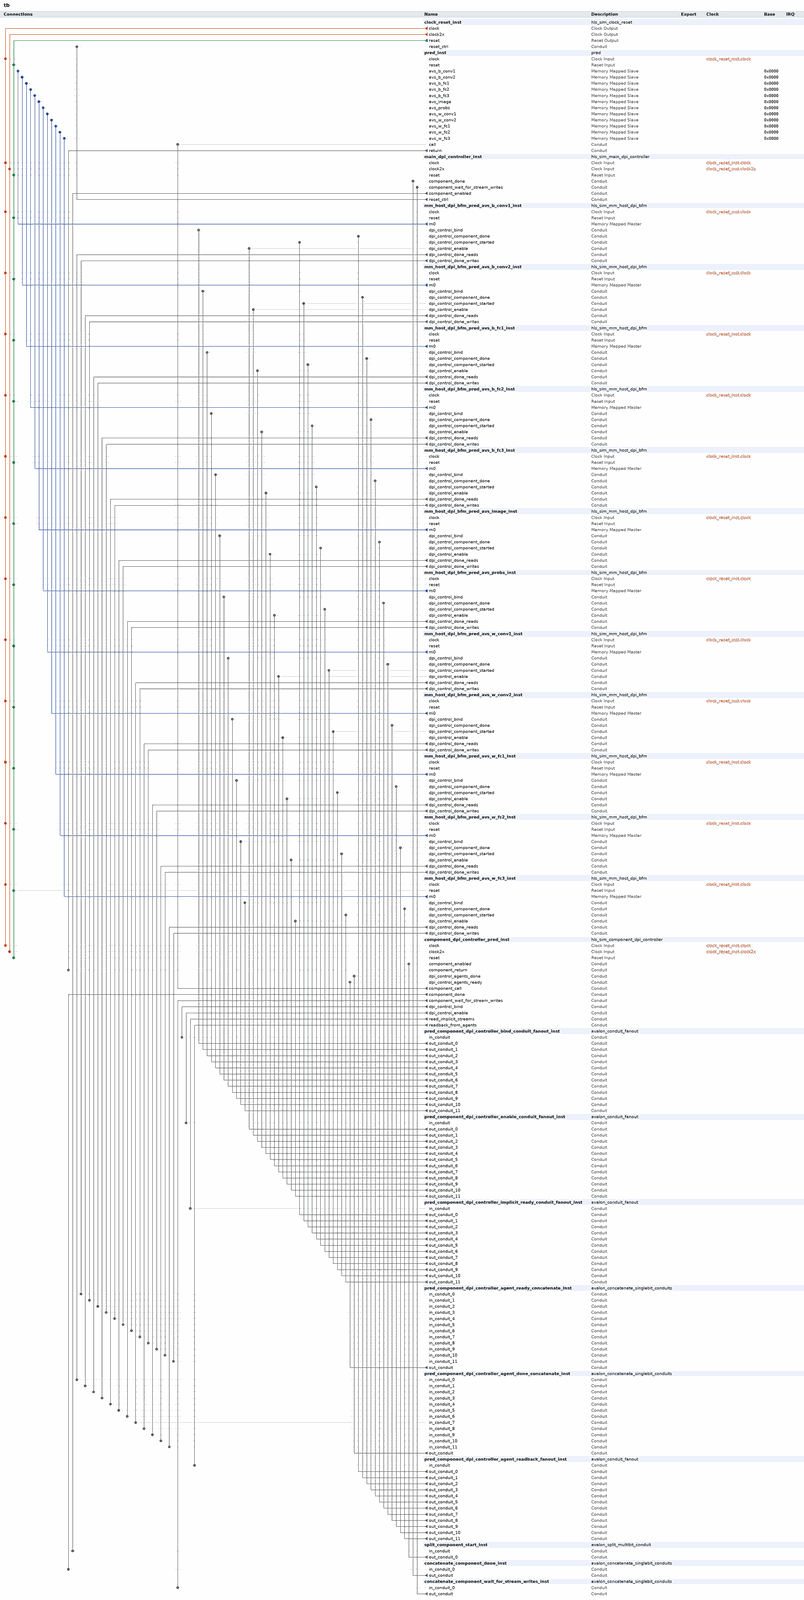
[diagram p0: system contents, whole]
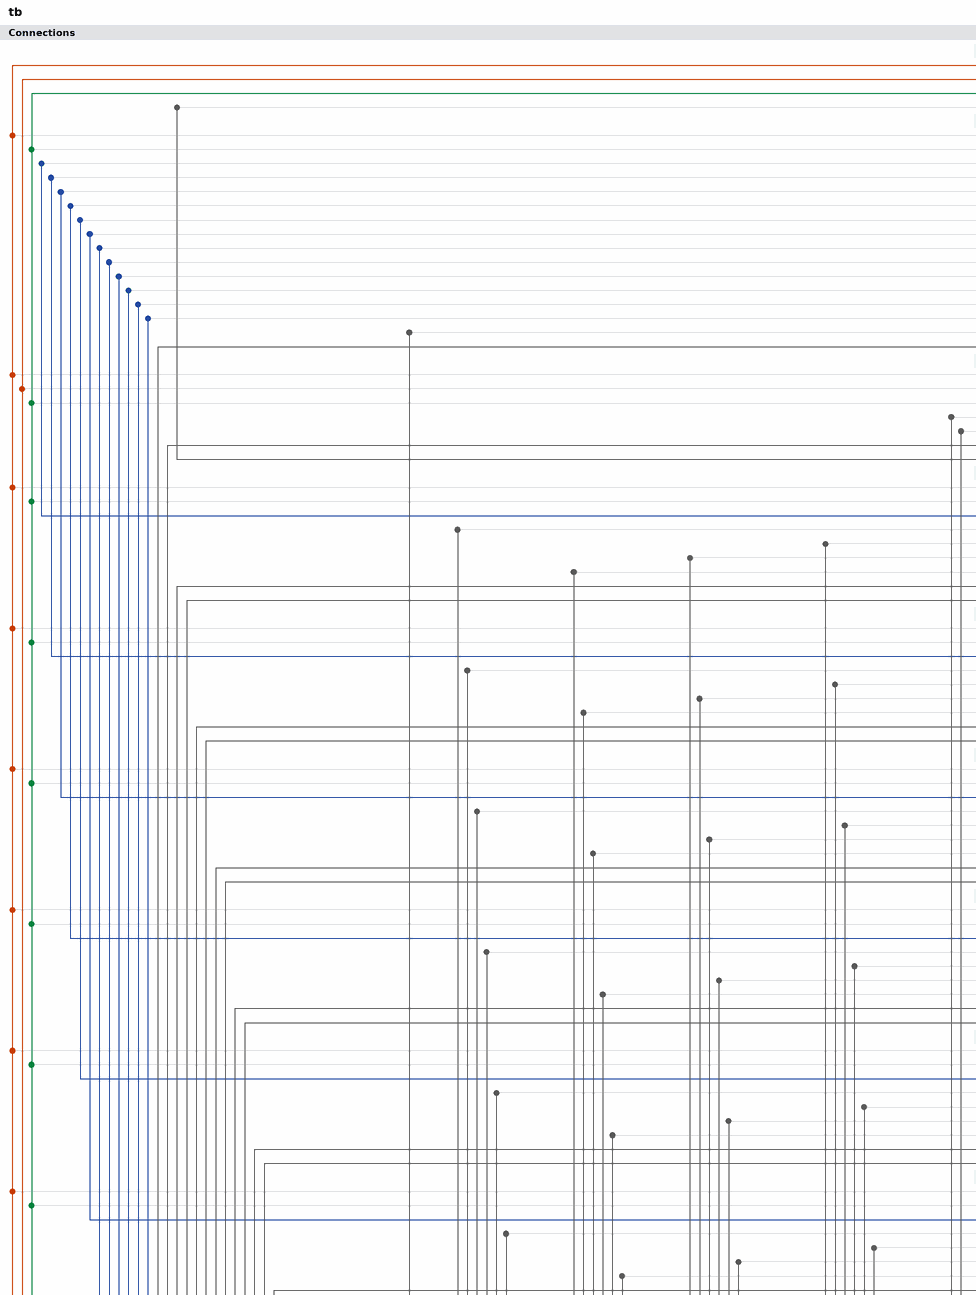
[diagram p1: system contents, upper left part]
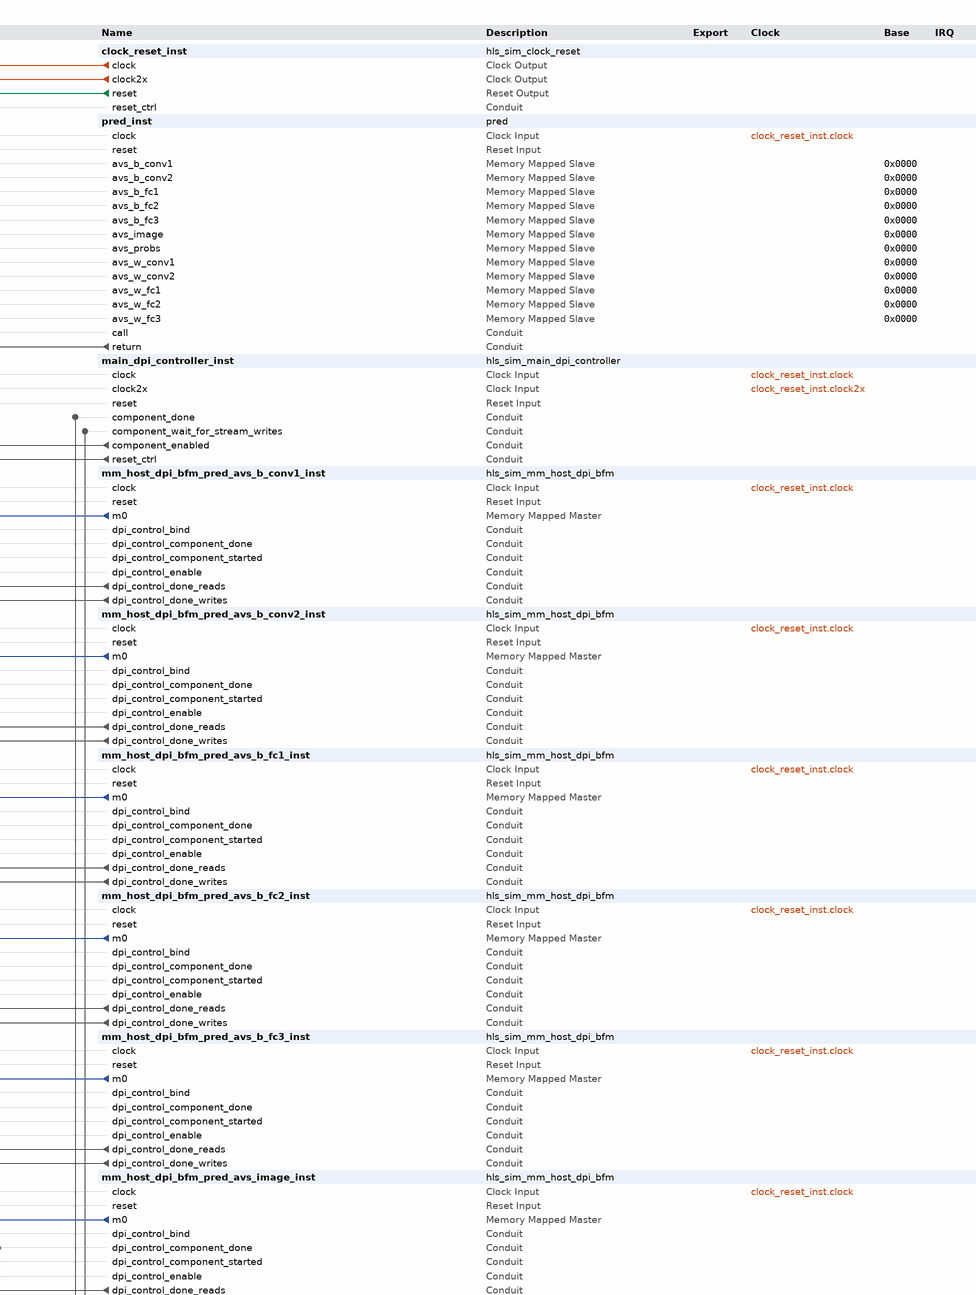
[diagram p2: system contents, upper right part]
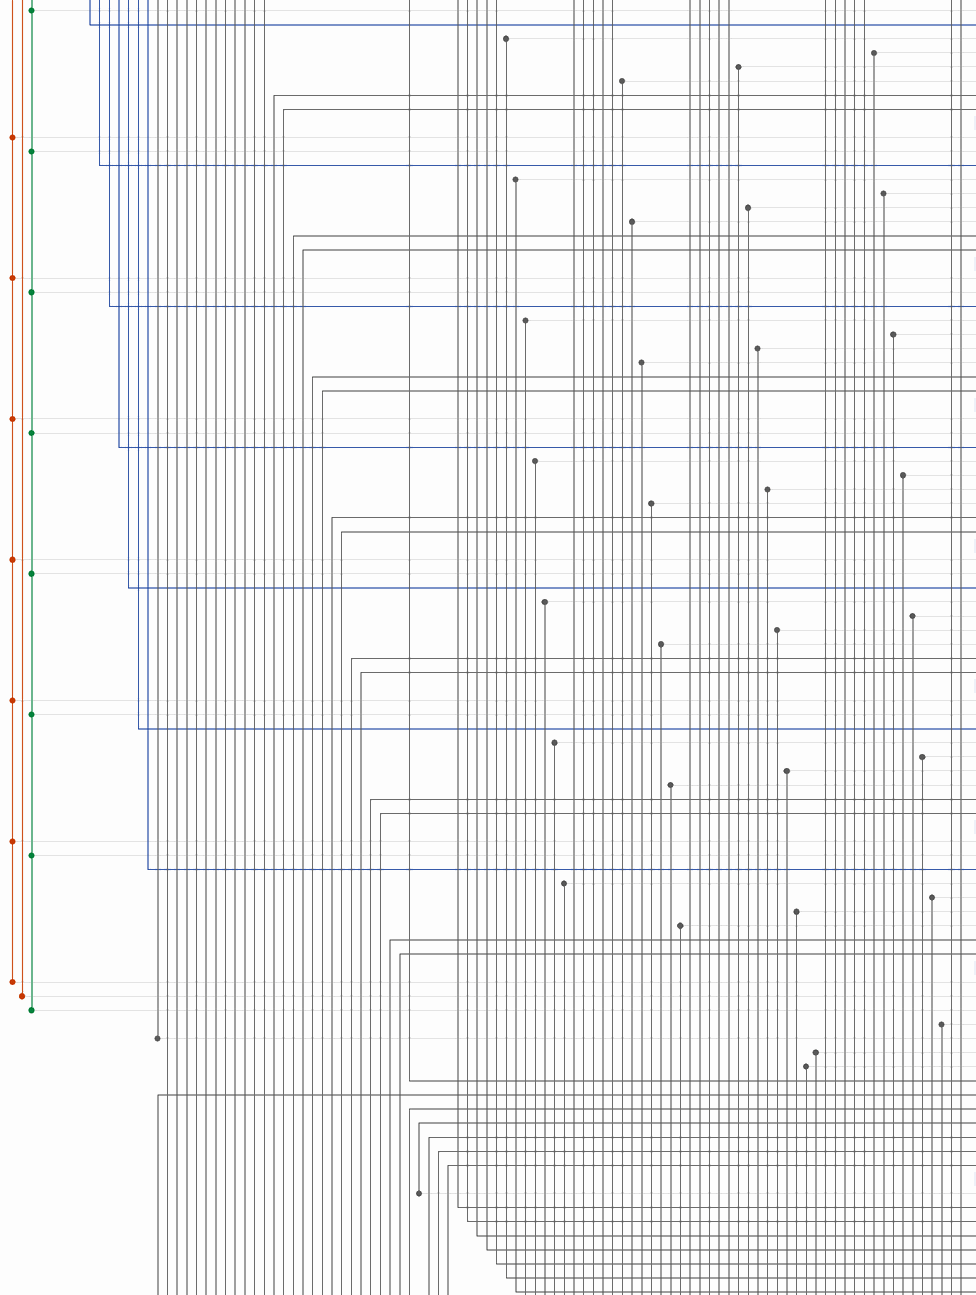
[diagram p3: system contents, middle left part]
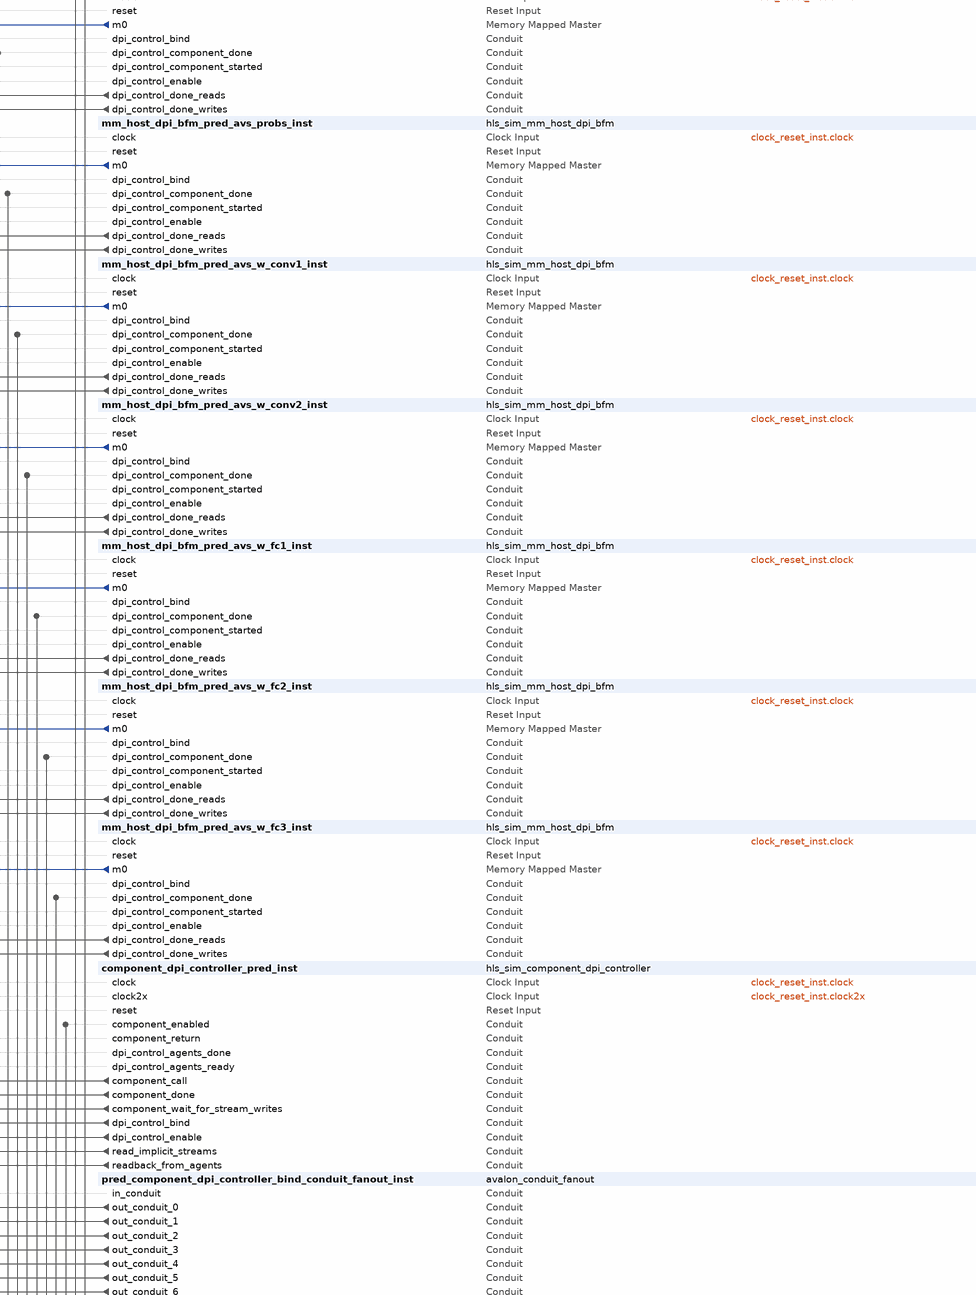
[diagram p4: system contents, middle right part]
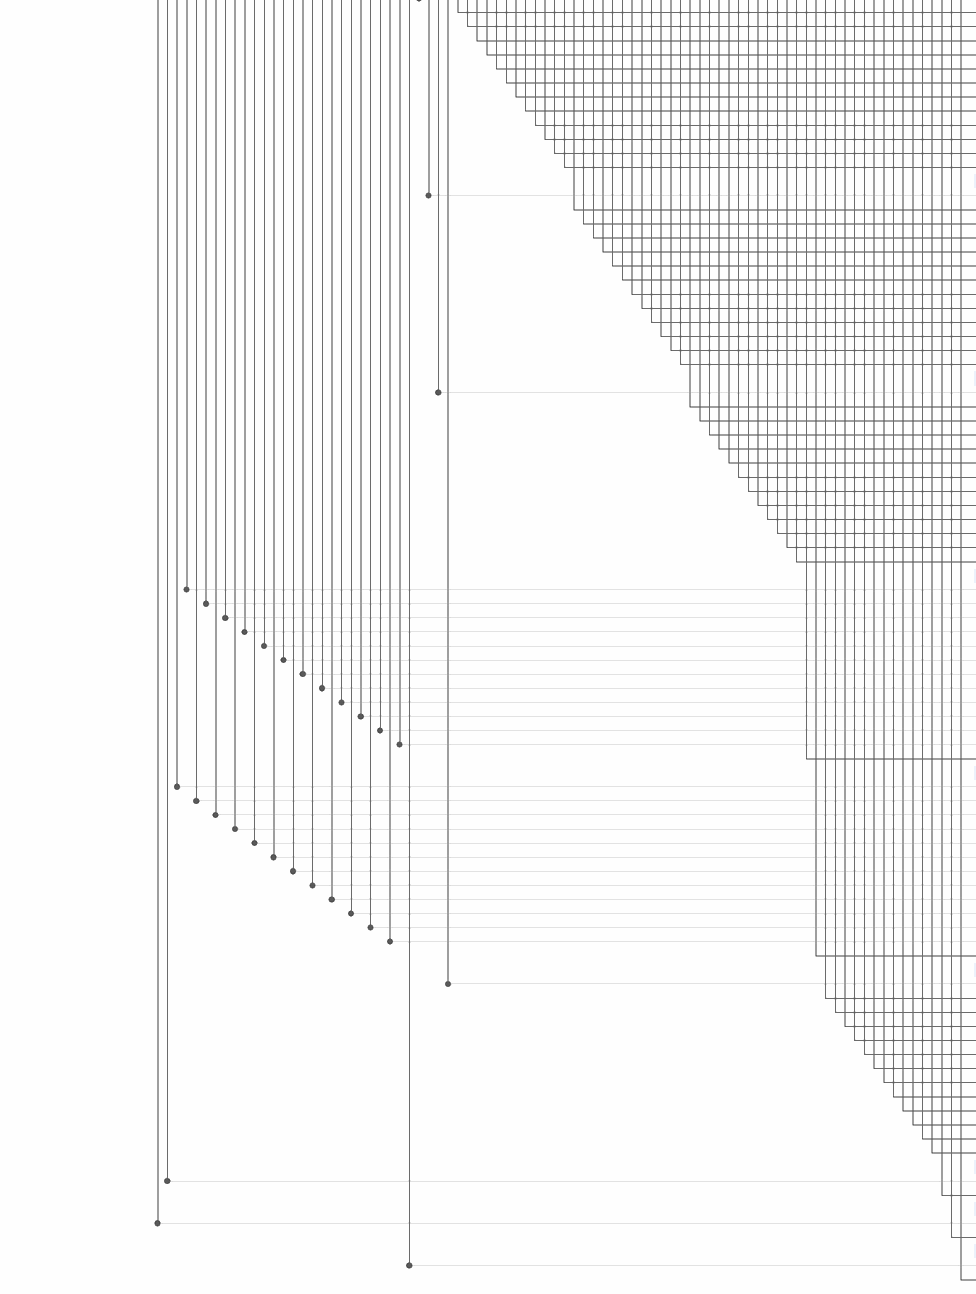
[diagram p5: system contents, lower left part]
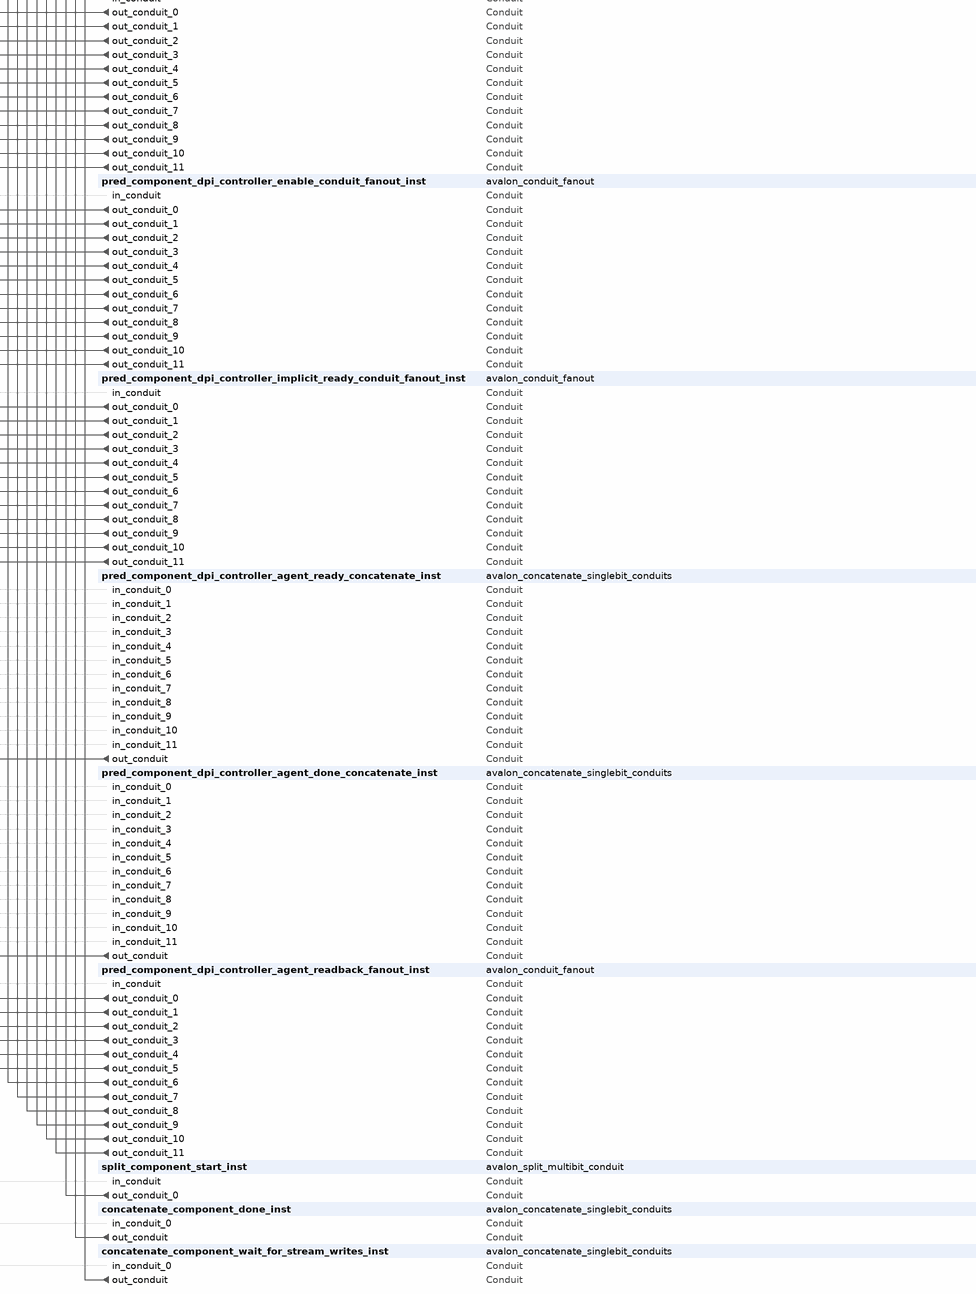
[diagram p6: system contents, lower right part]
# Platform Designer (Qsys) system tb, Cyclone V 5CGXFC3B6F23C6
# Parameters at their usual value, and those the tool derives, are not listed.
package require qsys
create_system tb
set_project_property DEVICE_FAMILY {Cyclone V}
set_project_property DEVICE 5CGXFC3B6F23C6

add_instance clock_reset_inst hls_sim_clock_reset 1.0
set_instance_parameter_value clock_reset_inst RESET_CYCLE_HOLD 4

add_instance pred_inst pred 1.0

add_instance main_dpi_controller_inst hls_sim_main_dpi_controller 1.0
set_instance_parameter_value main_dpi_controller_inst COMPONENT_NAMES_STR pred
set_instance_parameter_value main_dpi_controller_inst NUM_COMPONENTS 1

add_instance mm_host_dpi_bfm_pred_avs_b_conv1_inst hls_sim_mm_host_dpi_bfm 1.0
set_instance_parameter_value mm_host_dpi_bfm_pred_avs_b_conv1_inst ADDRESS_UNITS SYMBOLS
set_instance_parameter_value mm_host_dpi_bfm_pred_avs_b_conv1_inst AV_ADDRESS_W 5
set_instance_parameter_value mm_host_dpi_bfm_pred_avs_b_conv1_inst AV_BURSTCOUNT_W 1
set_instance_parameter_value mm_host_dpi_bfm_pred_avs_b_conv1_inst AV_BURST_BNDR_ONLY 1
set_instance_parameter_value mm_host_dpi_bfm_pred_avs_b_conv1_inst AV_BURST_LINEWRAP 1
set_instance_parameter_value mm_host_dpi_bfm_pred_avs_b_conv1_inst AV_FIX_READ_LATENCY 3
set_instance_parameter_value mm_host_dpi_bfm_pred_avs_b_conv1_inst AV_NUMSYMBOLS 1
set_instance_parameter_value mm_host_dpi_bfm_pred_avs_b_conv1_inst AV_READ_WAIT_TIME 0
set_instance_parameter_value mm_host_dpi_bfm_pred_avs_b_conv1_inst AV_REGISTERINCOMINGSIGNALS 0
set_instance_parameter_value mm_host_dpi_bfm_pred_avs_b_conv1_inst AV_SYMBOL_W 8
set_instance_parameter_value mm_host_dpi_bfm_pred_avs_b_conv1_inst AV_WRITE_WAIT_TIME 0
set_instance_parameter_value mm_host_dpi_bfm_pred_avs_b_conv1_inst COMPONENT_AGENT_READ_INTERFACE_NAME b_conv1_avs_readback
set_instance_parameter_value mm_host_dpi_bfm_pred_avs_b_conv1_inst COMPONENT_AGENT_WRITE_INTERFACE_NAME b_conv1
set_instance_parameter_value mm_host_dpi_bfm_pred_avs_b_conv1_inst COMPONENT_CRA_AGENT 0
set_instance_parameter_value mm_host_dpi_bfm_pred_avs_b_conv1_inst COMPONENT_HAS_AGENT_RETURN 0
set_instance_parameter_value mm_host_dpi_bfm_pred_avs_b_conv1_inst COMPONENT_NAME pred
set_instance_parameter_value mm_host_dpi_bfm_pred_avs_b_conv1_inst NUM_AGENT_MEMORIES 0
set_instance_parameter_value mm_host_dpi_bfm_pred_avs_b_conv1_inst REGISTER_WAITREQUEST 0
set_instance_parameter_value mm_host_dpi_bfm_pred_avs_b_conv1_inst USE_ADDRESS 1
set_instance_parameter_value mm_host_dpi_bfm_pred_avs_b_conv1_inst USE_BEGIN_BURST_TRANSFER 0
set_instance_parameter_value mm_host_dpi_bfm_pred_avs_b_conv1_inst USE_BEGIN_TRANSFER 0
set_instance_parameter_value mm_host_dpi_bfm_pred_avs_b_conv1_inst USE_BURSTCOUNT 0
set_instance_parameter_value mm_host_dpi_bfm_pred_avs_b_conv1_inst USE_BYTE_ENABLE 1
set_instance_parameter_value mm_host_dpi_bfm_pred_avs_b_conv1_inst USE_READ 1
set_instance_parameter_value mm_host_dpi_bfm_pred_avs_b_conv1_inst USE_READ_DATA 1
set_instance_parameter_value mm_host_dpi_bfm_pred_avs_b_conv1_inst USE_READ_DATA_VALID 1
set_instance_parameter_value mm_host_dpi_bfm_pred_avs_b_conv1_inst USE_WAIT_REQUEST 1
set_instance_parameter_value mm_host_dpi_bfm_pred_avs_b_conv1_inst USE_WRITE 1
set_instance_parameter_value mm_host_dpi_bfm_pred_avs_b_conv1_inst USE_WRITE_DATA 1

add_instance mm_host_dpi_bfm_pred_avs_b_conv2_inst hls_sim_mm_host_dpi_bfm 1.0
set_instance_parameter_value mm_host_dpi_bfm_pred_avs_b_conv2_inst ADDRESS_UNITS SYMBOLS
set_instance_parameter_value mm_host_dpi_bfm_pred_avs_b_conv2_inst AV_ADDRESS_W 6
set_instance_parameter_value mm_host_dpi_bfm_pred_avs_b_conv2_inst AV_BURSTCOUNT_W 1
set_instance_parameter_value mm_host_dpi_bfm_pred_avs_b_conv2_inst AV_BURST_BNDR_ONLY 1
set_instance_parameter_value mm_host_dpi_bfm_pred_avs_b_conv2_inst AV_BURST_LINEWRAP 1
set_instance_parameter_value mm_host_dpi_bfm_pred_avs_b_conv2_inst AV_FIX_READ_LATENCY 3
set_instance_parameter_value mm_host_dpi_bfm_pred_avs_b_conv2_inst AV_NUMSYMBOLS 1
set_instance_parameter_value mm_host_dpi_bfm_pred_avs_b_conv2_inst AV_READ_WAIT_TIME 0
set_instance_parameter_value mm_host_dpi_bfm_pred_avs_b_conv2_inst AV_REGISTERINCOMINGSIGNALS 0
set_instance_parameter_value mm_host_dpi_bfm_pred_avs_b_conv2_inst AV_SYMBOL_W 8
set_instance_parameter_value mm_host_dpi_bfm_pred_avs_b_conv2_inst AV_WRITE_WAIT_TIME 0
set_instance_parameter_value mm_host_dpi_bfm_pred_avs_b_conv2_inst COMPONENT_AGENT_READ_INTERFACE_NAME b_conv2_avs_readback
set_instance_parameter_value mm_host_dpi_bfm_pred_avs_b_conv2_inst COMPONENT_AGENT_WRITE_INTERFACE_NAME b_conv2
set_instance_parameter_value mm_host_dpi_bfm_pred_avs_b_conv2_inst COMPONENT_CRA_AGENT 0
set_instance_parameter_value mm_host_dpi_bfm_pred_avs_b_conv2_inst COMPONENT_HAS_AGENT_RETURN 0
set_instance_parameter_value mm_host_dpi_bfm_pred_avs_b_conv2_inst COMPONENT_NAME pred
set_instance_parameter_value mm_host_dpi_bfm_pred_avs_b_conv2_inst NUM_AGENT_MEMORIES 0
set_instance_parameter_value mm_host_dpi_bfm_pred_avs_b_conv2_inst REGISTER_WAITREQUEST 0
set_instance_parameter_value mm_host_dpi_bfm_pred_avs_b_conv2_inst USE_ADDRESS 1
set_instance_parameter_value mm_host_dpi_bfm_pred_avs_b_conv2_inst USE_BEGIN_BURST_TRANSFER 0
set_instance_parameter_value mm_host_dpi_bfm_pred_avs_b_conv2_inst USE_BEGIN_TRANSFER 0
set_instance_parameter_value mm_host_dpi_bfm_pred_avs_b_conv2_inst USE_BURSTCOUNT 0
set_instance_parameter_value mm_host_dpi_bfm_pred_avs_b_conv2_inst USE_BYTE_ENABLE 1
set_instance_parameter_value mm_host_dpi_bfm_pred_avs_b_conv2_inst USE_READ 1
set_instance_parameter_value mm_host_dpi_bfm_pred_avs_b_conv2_inst USE_READ_DATA 1
set_instance_parameter_value mm_host_dpi_bfm_pred_avs_b_conv2_inst USE_READ_DATA_VALID 1
set_instance_parameter_value mm_host_dpi_bfm_pred_avs_b_conv2_inst USE_WAIT_REQUEST 1
set_instance_parameter_value mm_host_dpi_bfm_pred_avs_b_conv2_inst USE_WRITE 1
set_instance_parameter_value mm_host_dpi_bfm_pred_avs_b_conv2_inst USE_WRITE_DATA 1

add_instance mm_host_dpi_bfm_pred_avs_b_fc1_inst hls_sim_mm_host_dpi_bfm 1.0
set_instance_parameter_value mm_host_dpi_bfm_pred_avs_b_fc1_inst ADDRESS_UNITS SYMBOLS
set_instance_parameter_value mm_host_dpi_bfm_pred_avs_b_fc1_inst AV_ADDRESS_W 9
set_instance_parameter_value mm_host_dpi_bfm_pred_avs_b_fc1_inst AV_BURSTCOUNT_W 1
set_instance_parameter_value mm_host_dpi_bfm_pred_avs_b_fc1_inst AV_BURST_BNDR_ONLY 1
set_instance_parameter_value mm_host_dpi_bfm_pred_avs_b_fc1_inst AV_BURST_LINEWRAP 1
set_instance_parameter_value mm_host_dpi_bfm_pred_avs_b_fc1_inst AV_FIX_READ_LATENCY 3
set_instance_parameter_value mm_host_dpi_bfm_pred_avs_b_fc1_inst AV_NUMSYMBOLS 1
set_instance_parameter_value mm_host_dpi_bfm_pred_avs_b_fc1_inst AV_READ_WAIT_TIME 0
set_instance_parameter_value mm_host_dpi_bfm_pred_avs_b_fc1_inst AV_REGISTERINCOMINGSIGNALS 0
set_instance_parameter_value mm_host_dpi_bfm_pred_avs_b_fc1_inst AV_SYMBOL_W 8
set_instance_parameter_value mm_host_dpi_bfm_pred_avs_b_fc1_inst AV_WRITE_WAIT_TIME 0
set_instance_parameter_value mm_host_dpi_bfm_pred_avs_b_fc1_inst COMPONENT_AGENT_READ_INTERFACE_NAME b_fc1_avs_readback
set_instance_parameter_value mm_host_dpi_bfm_pred_avs_b_fc1_inst COMPONENT_AGENT_WRITE_INTERFACE_NAME b_fc1
set_instance_parameter_value mm_host_dpi_bfm_pred_avs_b_fc1_inst COMPONENT_CRA_AGENT 0
set_instance_parameter_value mm_host_dpi_bfm_pred_avs_b_fc1_inst COMPONENT_HAS_AGENT_RETURN 0
set_instance_parameter_value mm_host_dpi_bfm_pred_avs_b_fc1_inst COMPONENT_NAME pred
set_instance_parameter_value mm_host_dpi_bfm_pred_avs_b_fc1_inst NUM_AGENT_MEMORIES 0
set_instance_parameter_value mm_host_dpi_bfm_pred_avs_b_fc1_inst REGISTER_WAITREQUEST 0
set_instance_parameter_value mm_host_dpi_bfm_pred_avs_b_fc1_inst USE_ADDRESS 1
set_instance_parameter_value mm_host_dpi_bfm_pred_avs_b_fc1_inst USE_BEGIN_BURST_TRANSFER 0
set_instance_parameter_value mm_host_dpi_bfm_pred_avs_b_fc1_inst USE_BEGIN_TRANSFER 0
set_instance_parameter_value mm_host_dpi_bfm_pred_avs_b_fc1_inst USE_BURSTCOUNT 0
set_instance_parameter_value mm_host_dpi_bfm_pred_avs_b_fc1_inst USE_BYTE_ENABLE 1
set_instance_parameter_value mm_host_dpi_bfm_pred_avs_b_fc1_inst USE_READ 1
set_instance_parameter_value mm_host_dpi_bfm_pred_avs_b_fc1_inst USE_READ_DATA 1
set_instance_parameter_value mm_host_dpi_bfm_pred_avs_b_fc1_inst USE_READ_DATA_VALID 1
set_instance_parameter_value mm_host_dpi_bfm_pred_avs_b_fc1_inst USE_WAIT_REQUEST 1
set_instance_parameter_value mm_host_dpi_bfm_pred_avs_b_fc1_inst USE_WRITE 1
set_instance_parameter_value mm_host_dpi_bfm_pred_avs_b_fc1_inst USE_WRITE_DATA 1

add_instance mm_host_dpi_bfm_pred_avs_b_fc2_inst hls_sim_mm_host_dpi_bfm 1.0
set_instance_parameter_value mm_host_dpi_bfm_pred_avs_b_fc2_inst ADDRESS_UNITS SYMBOLS
set_instance_parameter_value mm_host_dpi_bfm_pred_avs_b_fc2_inst AV_ADDRESS_W 9
set_instance_parameter_value mm_host_dpi_bfm_pred_avs_b_fc2_inst AV_BURSTCOUNT_W 1
set_instance_parameter_value mm_host_dpi_bfm_pred_avs_b_fc2_inst AV_BURST_BNDR_ONLY 1
set_instance_parameter_value mm_host_dpi_bfm_pred_avs_b_fc2_inst AV_BURST_LINEWRAP 1
set_instance_parameter_value mm_host_dpi_bfm_pred_avs_b_fc2_inst AV_FIX_READ_LATENCY 3
set_instance_parameter_value mm_host_dpi_bfm_pred_avs_b_fc2_inst AV_NUMSYMBOLS 1
set_instance_parameter_value mm_host_dpi_bfm_pred_avs_b_fc2_inst AV_READ_WAIT_TIME 0
set_instance_parameter_value mm_host_dpi_bfm_pred_avs_b_fc2_inst AV_REGISTERINCOMINGSIGNALS 0
set_instance_parameter_value mm_host_dpi_bfm_pred_avs_b_fc2_inst AV_SYMBOL_W 8
set_instance_parameter_value mm_host_dpi_bfm_pred_avs_b_fc2_inst AV_WRITE_WAIT_TIME 0
set_instance_parameter_value mm_host_dpi_bfm_pred_avs_b_fc2_inst COMPONENT_AGENT_READ_INTERFACE_NAME b_fc2_avs_readback
set_instance_parameter_value mm_host_dpi_bfm_pred_avs_b_fc2_inst COMPONENT_AGENT_WRITE_INTERFACE_NAME b_fc2
set_instance_parameter_value mm_host_dpi_bfm_pred_avs_b_fc2_inst COMPONENT_CRA_AGENT 0
set_instance_parameter_value mm_host_dpi_bfm_pred_avs_b_fc2_inst COMPONENT_HAS_AGENT_RETURN 0
set_instance_parameter_value mm_host_dpi_bfm_pred_avs_b_fc2_inst COMPONENT_NAME pred
set_instance_parameter_value mm_host_dpi_bfm_pred_avs_b_fc2_inst NUM_AGENT_MEMORIES 0
set_instance_parameter_value mm_host_dpi_bfm_pred_avs_b_fc2_inst REGISTER_WAITREQUEST 0
set_instance_parameter_value mm_host_dpi_bfm_pred_avs_b_fc2_inst USE_ADDRESS 1
set_instance_parameter_value mm_host_dpi_bfm_pred_avs_b_fc2_inst USE_BEGIN_BURST_TRANSFER 0
set_instance_parameter_value mm_host_dpi_bfm_pred_avs_b_fc2_inst USE_BEGIN_TRANSFER 0
set_instance_parameter_value mm_host_dpi_bfm_pred_avs_b_fc2_inst USE_BURSTCOUNT 0
set_instance_parameter_value mm_host_dpi_bfm_pred_avs_b_fc2_inst USE_BYTE_ENABLE 1
set_instance_parameter_value mm_host_dpi_bfm_pred_avs_b_fc2_inst USE_READ 1
set_instance_parameter_value mm_host_dpi_bfm_pred_avs_b_fc2_inst USE_READ_DATA 1
set_instance_parameter_value mm_host_dpi_bfm_pred_avs_b_fc2_inst USE_READ_DATA_VALID 1
set_instance_parameter_value mm_host_dpi_bfm_pred_avs_b_fc2_inst USE_WAIT_REQUEST 1
set_instance_parameter_value mm_host_dpi_bfm_pred_avs_b_fc2_inst USE_WRITE 1
set_instance_parameter_value mm_host_dpi_bfm_pred_avs_b_fc2_inst USE_WRITE_DATA 1

add_instance mm_host_dpi_bfm_pred_avs_b_fc3_inst hls_sim_mm_host_dpi_bfm 1.0
set_instance_parameter_value mm_host_dpi_bfm_pred_avs_b_fc3_inst ADDRESS_UNITS SYMBOLS
set_instance_parameter_value mm_host_dpi_bfm_pred_avs_b_fc3_inst AV_ADDRESS_W 6
set_instance_parameter_value mm_host_dpi_bfm_pred_avs_b_fc3_inst AV_BURSTCOUNT_W 1
set_instance_parameter_value mm_host_dpi_bfm_pred_avs_b_fc3_inst AV_BURST_BNDR_ONLY 1
set_instance_parameter_value mm_host_dpi_bfm_pred_avs_b_fc3_inst AV_BURST_LINEWRAP 1
set_instance_parameter_value mm_host_dpi_bfm_pred_avs_b_fc3_inst AV_FIX_READ_LATENCY 3
set_instance_parameter_value mm_host_dpi_bfm_pred_avs_b_fc3_inst AV_NUMSYMBOLS 1
set_instance_parameter_value mm_host_dpi_bfm_pred_avs_b_fc3_inst AV_READ_WAIT_TIME 0
set_instance_parameter_value mm_host_dpi_bfm_pred_avs_b_fc3_inst AV_REGISTERINCOMINGSIGNALS 0
set_instance_parameter_value mm_host_dpi_bfm_pred_avs_b_fc3_inst AV_SYMBOL_W 8
set_instance_parameter_value mm_host_dpi_bfm_pred_avs_b_fc3_inst AV_WRITE_WAIT_TIME 0
set_instance_parameter_value mm_host_dpi_bfm_pred_avs_b_fc3_inst COMPONENT_AGENT_READ_INTERFACE_NAME b_fc3_avs_readback
set_instance_parameter_value mm_host_dpi_bfm_pred_avs_b_fc3_inst COMPONENT_AGENT_WRITE_INTERFACE_NAME b_fc3
set_instance_parameter_value mm_host_dpi_bfm_pred_avs_b_fc3_inst COMPONENT_CRA_AGENT 0
set_instance_parameter_value mm_host_dpi_bfm_pred_avs_b_fc3_inst COMPONENT_HAS_AGENT_RETURN 0
set_instance_parameter_value mm_host_dpi_bfm_pred_avs_b_fc3_inst COMPONENT_NAME pred
set_instance_parameter_value mm_host_dpi_bfm_pred_avs_b_fc3_inst NUM_AGENT_MEMORIES 0
set_instance_parameter_value mm_host_dpi_bfm_pred_avs_b_fc3_inst REGISTER_WAITREQUEST 0
set_instance_parameter_value mm_host_dpi_bfm_pred_avs_b_fc3_inst USE_ADDRESS 1
set_instance_parameter_value mm_host_dpi_bfm_pred_avs_b_fc3_inst USE_BEGIN_BURST_TRANSFER 0
set_instance_parameter_value mm_host_dpi_bfm_pred_avs_b_fc3_inst USE_BEGIN_TRANSFER 0
set_instance_parameter_value mm_host_dpi_bfm_pred_avs_b_fc3_inst USE_BURSTCOUNT 0
set_instance_parameter_value mm_host_dpi_bfm_pred_avs_b_fc3_inst USE_BYTE_ENABLE 1
set_instance_parameter_value mm_host_dpi_bfm_pred_avs_b_fc3_inst USE_READ 1
set_instance_parameter_value mm_host_dpi_bfm_pred_avs_b_fc3_inst USE_READ_DATA 1
set_instance_parameter_value mm_host_dpi_bfm_pred_avs_b_fc3_inst USE_READ_DATA_VALID 1
set_instance_parameter_value mm_host_dpi_bfm_pred_avs_b_fc3_inst USE_WAIT_REQUEST 1
set_instance_parameter_value mm_host_dpi_bfm_pred_avs_b_fc3_inst USE_WRITE 1
set_instance_parameter_value mm_host_dpi_bfm_pred_avs_b_fc3_inst USE_WRITE_DATA 1

add_instance mm_host_dpi_bfm_pred_avs_image_inst hls_sim_mm_host_dpi_bfm 1.0
set_instance_parameter_value mm_host_dpi_bfm_pred_avs_image_inst ADDRESS_UNITS SYMBOLS
set_instance_parameter_value mm_host_dpi_bfm_pred_avs_image_inst AV_ADDRESS_W 12
set_instance_parameter_value mm_host_dpi_bfm_pred_avs_image_inst AV_BURSTCOUNT_W 1
set_instance_parameter_value mm_host_dpi_bfm_pred_avs_image_inst AV_BURST_BNDR_ONLY 1
set_instance_parameter_value mm_host_dpi_bfm_pred_avs_image_inst AV_BURST_LINEWRAP 1
set_instance_parameter_value mm_host_dpi_bfm_pred_avs_image_inst AV_FIX_READ_LATENCY 3
set_instance_parameter_value mm_host_dpi_bfm_pred_avs_image_inst AV_NUMSYMBOLS 1
set_instance_parameter_value mm_host_dpi_bfm_pred_avs_image_inst AV_READ_WAIT_TIME 0
set_instance_parameter_value mm_host_dpi_bfm_pred_avs_image_inst AV_REGISTERINCOMINGSIGNALS 0
set_instance_parameter_value mm_host_dpi_bfm_pred_avs_image_inst AV_SYMBOL_W 8
set_instance_parameter_value mm_host_dpi_bfm_pred_avs_image_inst AV_WRITE_WAIT_TIME 0
set_instance_parameter_value mm_host_dpi_bfm_pred_avs_image_inst COMPONENT_AGENT_READ_INTERFACE_NAME image_avs_readback
set_instance_parameter_value mm_host_dpi_bfm_pred_avs_image_inst COMPONENT_AGENT_WRITE_INTERFACE_NAME image
set_instance_parameter_value mm_host_dpi_bfm_pred_avs_image_inst COMPONENT_CRA_AGENT 0
set_instance_parameter_value mm_host_dpi_bfm_pred_avs_image_inst COMPONENT_HAS_AGENT_RETURN 0
set_instance_parameter_value mm_host_dpi_bfm_pred_avs_image_inst COMPONENT_NAME pred
set_instance_parameter_value mm_host_dpi_bfm_pred_avs_image_inst NUM_AGENT_MEMORIES 0
set_instance_parameter_value mm_host_dpi_bfm_pred_avs_image_inst REGISTER_WAITREQUEST 0
set_instance_parameter_value mm_host_dpi_bfm_pred_avs_image_inst USE_ADDRESS 1
set_instance_parameter_value mm_host_dpi_bfm_pred_avs_image_inst USE_BEGIN_BURST_TRANSFER 0
set_instance_parameter_value mm_host_dpi_bfm_pred_avs_image_inst USE_BEGIN_TRANSFER 0
set_instance_parameter_value mm_host_dpi_bfm_pred_avs_image_inst USE_BURSTCOUNT 0
set_instance_parameter_value mm_host_dpi_bfm_pred_avs_image_inst USE_BYTE_ENABLE 1
set_instance_parameter_value mm_host_dpi_bfm_pred_avs_image_inst USE_READ 1
set_instance_parameter_value mm_host_dpi_bfm_pred_avs_image_inst USE_READ_DATA 1
set_instance_parameter_value mm_host_dpi_bfm_pred_avs_image_inst USE_READ_DATA_VALID 1
set_instance_parameter_value mm_host_dpi_bfm_pred_avs_image_inst USE_WAIT_REQUEST 1
set_instance_parameter_value mm_host_dpi_bfm_pred_avs_image_inst USE_WRITE 1
set_instance_parameter_value mm_host_dpi_bfm_pred_avs_image_inst USE_WRITE_DATA 1

add_instance mm_host_dpi_bfm_pred_avs_probs_inst hls_sim_mm_host_dpi_bfm 1.0
set_instance_parameter_value mm_host_dpi_bfm_pred_avs_probs_inst ADDRESS_UNITS SYMBOLS
set_instance_parameter_value mm_host_dpi_bfm_pred_avs_probs_inst AV_ADDRESS_W 6
set_instance_parameter_value mm_host_dpi_bfm_pred_avs_probs_inst AV_BURSTCOUNT_W 1
set_instance_parameter_value mm_host_dpi_bfm_pred_avs_probs_inst AV_BURST_BNDR_ONLY 1
set_instance_parameter_value mm_host_dpi_bfm_pred_avs_probs_inst AV_BURST_LINEWRAP 1
set_instance_parameter_value mm_host_dpi_bfm_pred_avs_probs_inst AV_FIX_READ_LATENCY 3
set_instance_parameter_value mm_host_dpi_bfm_pred_avs_probs_inst AV_NUMSYMBOLS 1
set_instance_parameter_value mm_host_dpi_bfm_pred_avs_probs_inst AV_READ_WAIT_TIME 0
set_instance_parameter_value mm_host_dpi_bfm_pred_avs_probs_inst AV_REGISTERINCOMINGSIGNALS 0
set_instance_parameter_value mm_host_dpi_bfm_pred_avs_probs_inst AV_SYMBOL_W 8
set_instance_parameter_value mm_host_dpi_bfm_pred_avs_probs_inst AV_WRITE_WAIT_TIME 0
set_instance_parameter_value mm_host_dpi_bfm_pred_avs_probs_inst COMPONENT_AGENT_READ_INTERFACE_NAME probs_avs_readback
set_instance_parameter_value mm_host_dpi_bfm_pred_avs_probs_inst COMPONENT_AGENT_WRITE_INTERFACE_NAME probs
set_instance_parameter_value mm_host_dpi_bfm_pred_avs_probs_inst COMPONENT_CRA_AGENT 0
set_instance_parameter_value mm_host_dpi_bfm_pred_avs_probs_inst COMPONENT_HAS_AGENT_RETURN 0
set_instance_parameter_value mm_host_dpi_bfm_pred_avs_probs_inst COMPONENT_NAME pred
set_instance_parameter_value mm_host_dpi_bfm_pred_avs_probs_inst NUM_AGENT_MEMORIES 0
set_instance_parameter_value mm_host_dpi_bfm_pred_avs_probs_inst REGISTER_WAITREQUEST 0
set_instance_parameter_value mm_host_dpi_bfm_pred_avs_probs_inst USE_ADDRESS 1
set_instance_parameter_value mm_host_dpi_bfm_pred_avs_probs_inst USE_BEGIN_BURST_TRANSFER 0
set_instance_parameter_value mm_host_dpi_bfm_pred_avs_probs_inst USE_BEGIN_TRANSFER 0
set_instance_parameter_value mm_host_dpi_bfm_pred_avs_probs_inst USE_BURSTCOUNT 0
set_instance_parameter_value mm_host_dpi_bfm_pred_avs_probs_inst USE_BYTE_ENABLE 1
set_instance_parameter_value mm_host_dpi_bfm_pred_avs_probs_inst USE_READ 1
set_instance_parameter_value mm_host_dpi_bfm_pred_avs_probs_inst USE_READ_DATA 1
set_instance_parameter_value mm_host_dpi_bfm_pred_avs_probs_inst USE_READ_DATA_VALID 1
set_instance_parameter_value mm_host_dpi_bfm_pred_avs_probs_inst USE_WAIT_REQUEST 1
set_instance_parameter_value mm_host_dpi_bfm_pred_avs_probs_inst USE_WRITE 1
set_instance_parameter_value mm_host_dpi_bfm_pred_avs_probs_inst USE_WRITE_DATA 1

add_instance mm_host_dpi_bfm_pred_avs_w_conv1_inst hls_sim_mm_host_dpi_bfm 1.0
set_instance_parameter_value mm_host_dpi_bfm_pred_avs_w_conv1_inst ADDRESS_UNITS SYMBOLS
set_instance_parameter_value mm_host_dpi_bfm_pred_avs_w_conv1_inst AV_ADDRESS_W 5
set_instance_parameter_value mm_host_dpi_bfm_pred_avs_w_conv1_inst AV_BURSTCOUNT_W 1
set_instance_parameter_value mm_host_dpi_bfm_pred_avs_w_conv1_inst AV_BURST_BNDR_ONLY 1
set_instance_parameter_value mm_host_dpi_bfm_pred_avs_w_conv1_inst AV_BURST_LINEWRAP 1
set_instance_parameter_value mm_host_dpi_bfm_pred_avs_w_conv1_inst AV_FIX_READ_LATENCY 3
set_instance_parameter_value mm_host_dpi_bfm_pred_avs_w_conv1_inst AV_NUMSYMBOLS 1
set_instance_parameter_value mm_host_dpi_bfm_pred_avs_w_conv1_inst AV_READ_WAIT_TIME 0
set_instance_parameter_value mm_host_dpi_bfm_pred_avs_w_conv1_inst AV_REGISTERINCOMINGSIGNALS 0
set_instance_parameter_value mm_host_dpi_bfm_pred_avs_w_conv1_inst AV_SYMBOL_W 8
set_instance_parameter_value mm_host_dpi_bfm_pred_avs_w_conv1_inst AV_WRITE_WAIT_TIME 0
set_instance_parameter_value mm_host_dpi_bfm_pred_avs_w_conv1_inst COMPONENT_AGENT_READ_INTERFACE_NAME w_conv1_avs_readback
set_instance_parameter_value mm_host_dpi_bfm_pred_avs_w_conv1_inst COMPONENT_AGENT_WRITE_INTERFACE_NAME w_conv1
set_instance_parameter_value mm_host_dpi_bfm_pred_avs_w_conv1_inst COMPONENT_CRA_AGENT 0
set_instance_parameter_value mm_host_dpi_bfm_pred_avs_w_conv1_inst COMPONENT_HAS_AGENT_RETURN 0
set_instance_parameter_value mm_host_dpi_bfm_pred_avs_w_conv1_inst COMPONENT_NAME pred
set_instance_parameter_value mm_host_dpi_bfm_pred_avs_w_conv1_inst NUM_AGENT_MEMORIES 0
set_instance_parameter_value mm_host_dpi_bfm_pred_avs_w_conv1_inst REGISTER_WAITREQUEST 0
set_instance_parameter_value mm_host_dpi_bfm_pred_avs_w_conv1_inst USE_ADDRESS 1
set_instance_parameter_value mm_host_dpi_bfm_pred_avs_w_conv1_inst USE_BEGIN_BURST_TRANSFER 0
set_instance_parameter_value mm_host_dpi_bfm_pred_avs_w_conv1_inst USE_BEGIN_TRANSFER 0
set_instance_parameter_value mm_host_dpi_bfm_pred_avs_w_conv1_inst USE_BURSTCOUNT 0
set_instance_parameter_value mm_host_dpi_bfm_pred_avs_w_conv1_inst USE_BYTE_ENABLE 1
set_instance_parameter_value mm_host_dpi_bfm_pred_avs_w_conv1_inst USE_READ 1
set_instance_parameter_value mm_host_dpi_bfm_pred_avs_w_conv1_inst USE_READ_DATA 1
set_instance_parameter_value mm_host_dpi_bfm_pred_avs_w_conv1_inst USE_READ_DATA_VALID 1
set_instance_parameter_value mm_host_dpi_bfm_pred_avs_w_conv1_inst USE_WAIT_REQUEST 1
set_instance_parameter_value mm_host_dpi_bfm_pred_avs_w_conv1_inst USE_WRITE 1
set_instance_parameter_value mm_host_dpi_bfm_pred_avs_w_conv1_inst USE_WRITE_DATA 1

add_instance mm_host_dpi_bfm_pred_avs_w_conv2_inst hls_sim_mm_host_dpi_bfm 1.0
set_instance_parameter_value mm_host_dpi_bfm_pred_avs_w_conv2_inst ADDRESS_UNITS SYMBOLS
set_instance_parameter_value mm_host_dpi_bfm_pred_avs_w_conv2_inst AV_ADDRESS_W 14
set_instance_parameter_value mm_host_dpi_bfm_pred_avs_w_conv2_inst AV_BURSTCOUNT_W 1
set_instance_parameter_value mm_host_dpi_bfm_pred_avs_w_conv2_inst AV_BURST_BNDR_ONLY 1
set_instance_parameter_value mm_host_dpi_bfm_pred_avs_w_conv2_inst AV_BURST_LINEWRAP 1
set_instance_parameter_value mm_host_dpi_bfm_pred_avs_w_conv2_inst AV_FIX_READ_LATENCY 3
set_instance_parameter_value mm_host_dpi_bfm_pred_avs_w_conv2_inst AV_NUMSYMBOLS 1
set_instance_parameter_value mm_host_dpi_bfm_pred_avs_w_conv2_inst AV_READ_WAIT_TIME 0
set_instance_parameter_value mm_host_dpi_bfm_pred_avs_w_conv2_inst AV_REGISTERINCOMINGSIGNALS 0
set_instance_parameter_value mm_host_dpi_bfm_pred_avs_w_conv2_inst AV_SYMBOL_W 8
set_instance_parameter_value mm_host_dpi_bfm_pred_avs_w_conv2_inst AV_WRITE_WAIT_TIME 0
set_instance_parameter_value mm_host_dpi_bfm_pred_avs_w_conv2_inst COMPONENT_AGENT_READ_INTERFACE_NAME w_conv2_avs_readback
set_instance_parameter_value mm_host_dpi_bfm_pred_avs_w_conv2_inst COMPONENT_AGENT_WRITE_INTERFACE_NAME w_conv2
set_instance_parameter_value mm_host_dpi_bfm_pred_avs_w_conv2_inst COMPONENT_CRA_AGENT 0
set_instance_parameter_value mm_host_dpi_bfm_pred_avs_w_conv2_inst COMPONENT_HAS_AGENT_RETURN 0
set_instance_parameter_value mm_host_dpi_bfm_pred_avs_w_conv2_inst COMPONENT_NAME pred
set_instance_parameter_value mm_host_dpi_bfm_pred_avs_w_conv2_inst NUM_AGENT_MEMORIES 0
set_instance_parameter_value mm_host_dpi_bfm_pred_avs_w_conv2_inst REGISTER_WAITREQUEST 0
set_instance_parameter_value mm_host_dpi_bfm_pred_avs_w_conv2_inst USE_ADDRESS 1
set_instance_parameter_value mm_host_dpi_bfm_pred_avs_w_conv2_inst USE_BEGIN_BURST_TRANSFER 0
set_instance_parameter_value mm_host_dpi_bfm_pred_avs_w_conv2_inst USE_BEGIN_TRANSFER 0
set_instance_parameter_value mm_host_dpi_bfm_pred_avs_w_conv2_inst USE_BURSTCOUNT 0
set_instance_parameter_value mm_host_dpi_bfm_pred_avs_w_conv2_inst USE_BYTE_ENABLE 1
set_instance_parameter_value mm_host_dpi_bfm_pred_avs_w_conv2_inst USE_READ 1
set_instance_parameter_value mm_host_dpi_bfm_pred_avs_w_conv2_inst USE_READ_DATA 1
set_instance_parameter_value mm_host_dpi_bfm_pred_avs_w_conv2_inst USE_READ_DATA_VALID 1
set_instance_parameter_value mm_host_dpi_bfm_pred_avs_w_conv2_inst USE_WAIT_REQUEST 1
set_instance_parameter_value mm_host_dpi_bfm_pred_avs_w_conv2_inst USE_WRITE 1
set_instance_parameter_value mm_host_dpi_bfm_pred_avs_w_conv2_inst USE_WRITE_DATA 1

add_instance mm_host_dpi_bfm_pred_avs_w_fc1_inst hls_sim_mm_host_dpi_bfm 1.0
set_instance_parameter_value mm_host_dpi_bfm_pred_avs_w_fc1_inst ADDRESS_UNITS SYMBOLS
set_instance_parameter_value mm_host_dpi_bfm_pred_avs_w_fc1_inst AV_ADDRESS_W 18
set_instance_parameter_value mm_host_dpi_bfm_pred_avs_w_fc1_inst AV_BURSTCOUNT_W 1
set_instance_parameter_value mm_host_dpi_bfm_pred_avs_w_fc1_inst AV_BURST_BNDR_ONLY 1
set_instance_parameter_value mm_host_dpi_bfm_pred_avs_w_fc1_inst AV_BURST_LINEWRAP 1
set_instance_parameter_value mm_host_dpi_bfm_pred_avs_w_fc1_inst AV_FIX_READ_LATENCY 3
set_instance_parameter_value mm_host_dpi_bfm_pred_avs_w_fc1_inst AV_NUMSYMBOLS 1
set_instance_parameter_value mm_host_dpi_bfm_pred_avs_w_fc1_inst AV_READ_WAIT_TIME 0
set_instance_parameter_value mm_host_dpi_bfm_pred_avs_w_fc1_inst AV_REGISTERINCOMINGSIGNALS 0
set_instance_parameter_value mm_host_dpi_bfm_pred_avs_w_fc1_inst AV_SYMBOL_W 8
set_instance_parameter_value mm_host_dpi_bfm_pred_avs_w_fc1_inst AV_WRITE_WAIT_TIME 0
set_instance_parameter_value mm_host_dpi_bfm_pred_avs_w_fc1_inst COMPONENT_AGENT_READ_INTERFACE_NAME w_fc1_avs_readback
set_instance_parameter_value mm_host_dpi_bfm_pred_avs_w_fc1_inst COMPONENT_AGENT_WRITE_INTERFACE_NAME w_fc1
set_instance_parameter_value mm_host_dpi_bfm_pred_avs_w_fc1_inst COMPONENT_CRA_AGENT 0
set_instance_parameter_value mm_host_dpi_bfm_pred_avs_w_fc1_inst COMPONENT_HAS_AGENT_RETURN 0
set_instance_parameter_value mm_host_dpi_bfm_pred_avs_w_fc1_inst COMPONENT_NAME pred
set_instance_parameter_value mm_host_dpi_bfm_pred_avs_w_fc1_inst NUM_AGENT_MEMORIES 0
set_instance_parameter_value mm_host_dpi_bfm_pred_avs_w_fc1_inst REGISTER_WAITREQUEST 0
set_instance_parameter_value mm_host_dpi_bfm_pred_avs_w_fc1_inst USE_ADDRESS 1
set_instance_parameter_value mm_host_dpi_bfm_pred_avs_w_fc1_inst USE_BEGIN_BURST_TRANSFER 0
set_instance_parameter_value mm_host_dpi_bfm_pred_avs_w_fc1_inst USE_BEGIN_TRANSFER 0
set_instance_parameter_value mm_host_dpi_bfm_pred_avs_w_fc1_inst USE_BURSTCOUNT 0
set_instance_parameter_value mm_host_dpi_bfm_pred_avs_w_fc1_inst USE_BYTE_ENABLE 1
set_instance_parameter_value mm_host_dpi_bfm_pred_avs_w_fc1_inst USE_READ 1
set_instance_parameter_value mm_host_dpi_bfm_pred_avs_w_fc1_inst USE_READ_DATA 1
set_instance_parameter_value mm_host_dpi_bfm_pred_avs_w_fc1_inst USE_READ_DATA_VALID 1
set_instance_parameter_value mm_host_dpi_bfm_pred_avs_w_fc1_inst USE_WAIT_REQUEST 1
set_instance_parameter_value mm_host_dpi_bfm_pred_avs_w_fc1_inst USE_WRITE 1
set_instance_parameter_value mm_host_dpi_bfm_pred_avs_w_fc1_inst USE_WRITE_DATA 1

add_instance mm_host_dpi_bfm_pred_avs_w_fc2_inst hls_sim_mm_host_dpi_bfm 1.0
set_instance_parameter_value mm_host_dpi_bfm_pred_avs_w_fc2_inst ADDRESS_UNITS SYMBOLS
set_instance_parameter_value mm_host_dpi_bfm_pred_avs_w_fc2_inst AV_ADDRESS_W 16
set_instance_parameter_value mm_host_dpi_bfm_pred_avs_w_fc2_inst AV_BURSTCOUNT_W 1
set_instance_parameter_value mm_host_dpi_bfm_pred_avs_w_fc2_inst AV_BURST_BNDR_ONLY 1
set_instance_parameter_value mm_host_dpi_bfm_pred_avs_w_fc2_inst AV_BURST_LINEWRAP 1
set_instance_parameter_value mm_host_dpi_bfm_pred_avs_w_fc2_inst AV_FIX_READ_LATENCY 3
set_instance_parameter_value mm_host_dpi_bfm_pred_avs_w_fc2_inst AV_NUMSYMBOLS 1
set_instance_parameter_value mm_host_dpi_bfm_pred_avs_w_fc2_inst AV_READ_WAIT_TIME 0
set_instance_parameter_value mm_host_dpi_bfm_pred_avs_w_fc2_inst AV_REGISTERINCOMINGSIGNALS 0
set_instance_parameter_value mm_host_dpi_bfm_pred_avs_w_fc2_inst AV_SYMBOL_W 8
set_instance_parameter_value mm_host_dpi_bfm_pred_avs_w_fc2_inst AV_WRITE_WAIT_TIME 0
set_instance_parameter_value mm_host_dpi_bfm_pred_avs_w_fc2_inst COMPONENT_AGENT_READ_INTERFACE_NAME w_fc2_avs_readback
set_instance_parameter_value mm_host_dpi_bfm_pred_avs_w_fc2_inst COMPONENT_AGENT_WRITE_INTERFACE_NAME w_fc2
set_instance_parameter_value mm_host_dpi_bfm_pred_avs_w_fc2_inst COMPONENT_CRA_AGENT 0
set_instance_parameter_value mm_host_dpi_bfm_pred_avs_w_fc2_inst COMPONENT_HAS_AGENT_RETURN 0
set_instance_parameter_value mm_host_dpi_bfm_pred_avs_w_fc2_inst COMPONENT_NAME pred
set_instance_parameter_value mm_host_dpi_bfm_pred_avs_w_fc2_inst NUM_AGENT_MEMORIES 0
set_instance_parameter_value mm_host_dpi_bfm_pred_avs_w_fc2_inst REGISTER_WAITREQUEST 0
set_instance_parameter_value mm_host_dpi_bfm_pred_avs_w_fc2_inst USE_ADDRESS 1
set_instance_parameter_value mm_host_dpi_bfm_pred_avs_w_fc2_inst USE_BEGIN_BURST_TRANSFER 0
set_instance_parameter_value mm_host_dpi_bfm_pred_avs_w_fc2_inst USE_BEGIN_TRANSFER 0
set_instance_parameter_value mm_host_dpi_bfm_pred_avs_w_fc2_inst USE_BURSTCOUNT 0
set_instance_parameter_value mm_host_dpi_bfm_pred_avs_w_fc2_inst USE_BYTE_ENABLE 1
set_instance_parameter_value mm_host_dpi_bfm_pred_avs_w_fc2_inst USE_READ 1
set_instance_parameter_value mm_host_dpi_bfm_pred_avs_w_fc2_inst USE_READ_DATA 1
set_instance_parameter_value mm_host_dpi_bfm_pred_avs_w_fc2_inst USE_READ_DATA_VALID 1
set_instance_parameter_value mm_host_dpi_bfm_pred_avs_w_fc2_inst USE_WAIT_REQUEST 1
set_instance_parameter_value mm_host_dpi_bfm_pred_avs_w_fc2_inst USE_WRITE 1
set_instance_parameter_value mm_host_dpi_bfm_pred_avs_w_fc2_inst USE_WRITE_DATA 1

add_instance mm_host_dpi_bfm_pred_avs_w_fc3_inst hls_sim_mm_host_dpi_bfm 1.0
set_instance_parameter_value mm_host_dpi_bfm_pred_avs_w_fc3_inst ADDRESS_UNITS SYMBOLS
set_instance_parameter_value mm_host_dpi_bfm_pred_avs_w_fc3_inst AV_ADDRESS_W 12
set_instance_parameter_value mm_host_dpi_bfm_pred_avs_w_fc3_inst AV_BURSTCOUNT_W 1
set_instance_parameter_value mm_host_dpi_bfm_pred_avs_w_fc3_inst AV_BURST_BNDR_ONLY 1
set_instance_parameter_value mm_host_dpi_bfm_pred_avs_w_fc3_inst AV_BURST_LINEWRAP 1
set_instance_parameter_value mm_host_dpi_bfm_pred_avs_w_fc3_inst AV_FIX_READ_LATENCY 3
set_instance_parameter_value mm_host_dpi_bfm_pred_avs_w_fc3_inst AV_NUMSYMBOLS 1
set_instance_parameter_value mm_host_dpi_bfm_pred_avs_w_fc3_inst AV_READ_WAIT_TIME 0
set_instance_parameter_value mm_host_dpi_bfm_pred_avs_w_fc3_inst AV_REGISTERINCOMINGSIGNALS 0
set_instance_parameter_value mm_host_dpi_bfm_pred_avs_w_fc3_inst AV_SYMBOL_W 8
set_instance_parameter_value mm_host_dpi_bfm_pred_avs_w_fc3_inst AV_WRITE_WAIT_TIME 0
set_instance_parameter_value mm_host_dpi_bfm_pred_avs_w_fc3_inst COMPONENT_AGENT_READ_INTERFACE_NAME w_fc3_avs_readback
set_instance_parameter_value mm_host_dpi_bfm_pred_avs_w_fc3_inst COMPONENT_AGENT_WRITE_INTERFACE_NAME w_fc3
set_instance_parameter_value mm_host_dpi_bfm_pred_avs_w_fc3_inst COMPONENT_CRA_AGENT 0
set_instance_parameter_value mm_host_dpi_bfm_pred_avs_w_fc3_inst COMPONENT_HAS_AGENT_RETURN 0
set_instance_parameter_value mm_host_dpi_bfm_pred_avs_w_fc3_inst COMPONENT_NAME pred
set_instance_parameter_value mm_host_dpi_bfm_pred_avs_w_fc3_inst NUM_AGENT_MEMORIES 0
set_instance_parameter_value mm_host_dpi_bfm_pred_avs_w_fc3_inst REGISTER_WAITREQUEST 0
set_instance_parameter_value mm_host_dpi_bfm_pred_avs_w_fc3_inst USE_ADDRESS 1
set_instance_parameter_value mm_host_dpi_bfm_pred_avs_w_fc3_inst USE_BEGIN_BURST_TRANSFER 0
set_instance_parameter_value mm_host_dpi_bfm_pred_avs_w_fc3_inst USE_BEGIN_TRANSFER 0
set_instance_parameter_value mm_host_dpi_bfm_pred_avs_w_fc3_inst USE_BURSTCOUNT 0
set_instance_parameter_value mm_host_dpi_bfm_pred_avs_w_fc3_inst USE_BYTE_ENABLE 1
set_instance_parameter_value mm_host_dpi_bfm_pred_avs_w_fc3_inst USE_READ 1
set_instance_parameter_value mm_host_dpi_bfm_pred_avs_w_fc3_inst USE_READ_DATA 1
set_instance_parameter_value mm_host_dpi_bfm_pred_avs_w_fc3_inst USE_READ_DATA_VALID 1
set_instance_parameter_value mm_host_dpi_bfm_pred_avs_w_fc3_inst USE_WAIT_REQUEST 1
set_instance_parameter_value mm_host_dpi_bfm_pred_avs_w_fc3_inst USE_WRITE 1
set_instance_parameter_value mm_host_dpi_bfm_pred_avs_w_fc3_inst USE_WRITE_DATA 1

add_instance component_dpi_controller_pred_inst hls_sim_component_dpi_controller 1.0
set_instance_parameter_value component_dpi_controller_pred_inst COMPONENT_HAS_AGENT_RETURN 0
set_instance_parameter_value component_dpi_controller_pred_inst COMPONENT_MANGLED_NAME "\\3fpred@@YAXPEAM00000000000@Z"
set_instance_parameter_value component_dpi_controller_pred_inst COMPONENT_NAME pred
set_instance_parameter_value component_dpi_controller_pred_inst COMPONENT_NUM_AGENTS 12
set_instance_parameter_value component_dpi_controller_pred_inst COMPONENT_NUM_OUTPUT_STREAMS 0
set_instance_parameter_value component_dpi_controller_pred_inst RETURN_DATAWIDTH 64

add_instance pred_component_dpi_controller_bind_conduit_fanout_inst avalon_conduit_fanout 1.0
set_instance_parameter_value pred_component_dpi_controller_bind_conduit_fanout_inst numFanOut 12

add_instance pred_component_dpi_controller_enable_conduit_fanout_inst avalon_conduit_fanout 1.0
set_instance_parameter_value pred_component_dpi_controller_enable_conduit_fanout_inst numFanOut 12

add_instance pred_component_dpi_controller_implicit_ready_conduit_fanout_inst avalon_conduit_fanout 1.0
set_instance_parameter_value pred_component_dpi_controller_implicit_ready_conduit_fanout_inst numFanOut 12

add_instance pred_component_dpi_controller_agent_ready_concatenate_inst avalon_concatenate_singlebit_conduits 1.0
set_instance_parameter_value pred_component_dpi_controller_agent_ready_concatenate_inst multibit_width 12

add_instance pred_component_dpi_controller_agent_done_concatenate_inst avalon_concatenate_singlebit_conduits 1.0
set_instance_parameter_value pred_component_dpi_controller_agent_done_concatenate_inst multibit_width 12

add_instance pred_component_dpi_controller_agent_readback_fanout_inst avalon_conduit_fanout 1.0
set_instance_parameter_value pred_component_dpi_controller_agent_readback_fanout_inst numFanOut 12

add_instance split_component_start_inst avalon_split_multibit_conduit 1.0
set_instance_parameter_value split_component_start_inst multibit_width 1

add_instance concatenate_component_done_inst avalon_concatenate_singlebit_conduits 1.0
set_instance_parameter_value concatenate_component_done_inst multibit_width 1

add_instance concatenate_component_wait_for_stream_writes_inst avalon_concatenate_singlebit_conduits 1.0
set_instance_parameter_value concatenate_component_wait_for_stream_writes_inst multibit_width 1

# connections
add_connection clock_reset_inst.clock component_dpi_controller_pred_inst.clock clock
add_connection clock_reset_inst.clock main_dpi_controller_inst.clock clock
add_connection clock_reset_inst.clock mm_host_dpi_bfm_pred_avs_b_conv1_inst.clock clock
add_connection clock_reset_inst.clock mm_host_dpi_bfm_pred_avs_b_conv2_inst.clock clock
add_connection clock_reset_inst.clock mm_host_dpi_bfm_pred_avs_b_fc1_inst.clock clock
add_connection clock_reset_inst.clock mm_host_dpi_bfm_pred_avs_b_fc2_inst.clock clock
add_connection clock_reset_inst.clock mm_host_dpi_bfm_pred_avs_b_fc3_inst.clock clock
add_connection clock_reset_inst.clock mm_host_dpi_bfm_pred_avs_image_inst.clock clock
add_connection clock_reset_inst.clock mm_host_dpi_bfm_pred_avs_probs_inst.clock clock
add_connection clock_reset_inst.clock mm_host_dpi_bfm_pred_avs_w_conv1_inst.clock clock
add_connection clock_reset_inst.clock mm_host_dpi_bfm_pred_avs_w_conv2_inst.clock clock
add_connection clock_reset_inst.clock mm_host_dpi_bfm_pred_avs_w_fc1_inst.clock clock
add_connection clock_reset_inst.clock mm_host_dpi_bfm_pred_avs_w_fc2_inst.clock clock
add_connection clock_reset_inst.clock mm_host_dpi_bfm_pred_avs_w_fc3_inst.clock clock
add_connection clock_reset_inst.clock pred_inst.clock clock
add_connection clock_reset_inst.clock2x component_dpi_controller_pred_inst.clock2x clock
add_connection clock_reset_inst.clock2x main_dpi_controller_inst.clock2x clock
add_connection clock_reset_inst.reset component_dpi_controller_pred_inst.reset reset
add_connection clock_reset_inst.reset main_dpi_controller_inst.reset reset
add_connection clock_reset_inst.reset mm_host_dpi_bfm_pred_avs_b_conv1_inst.reset reset
add_connection clock_reset_inst.reset mm_host_dpi_bfm_pred_avs_b_conv2_inst.reset reset
add_connection clock_reset_inst.reset mm_host_dpi_bfm_pred_avs_b_fc1_inst.reset reset
add_connection clock_reset_inst.reset mm_host_dpi_bfm_pred_avs_b_fc2_inst.reset reset
add_connection clock_reset_inst.reset mm_host_dpi_bfm_pred_avs_b_fc3_inst.reset reset
add_connection clock_reset_inst.reset mm_host_dpi_bfm_pred_avs_image_inst.reset reset
add_connection clock_reset_inst.reset mm_host_dpi_bfm_pred_avs_probs_inst.reset reset
add_connection clock_reset_inst.reset mm_host_dpi_bfm_pred_avs_w_conv1_inst.reset reset
add_connection clock_reset_inst.reset mm_host_dpi_bfm_pred_avs_w_conv2_inst.reset reset
add_connection clock_reset_inst.reset mm_host_dpi_bfm_pred_avs_w_fc1_inst.reset reset
add_connection clock_reset_inst.reset mm_host_dpi_bfm_pred_avs_w_fc2_inst.reset reset
add_connection clock_reset_inst.reset mm_host_dpi_bfm_pred_avs_w_fc3_inst.reset reset
add_connection clock_reset_inst.reset pred_inst.reset reset
add_connection mm_host_dpi_bfm_pred_avs_b_conv1_inst.m0 pred_inst.avs_b_conv1 avalon
set_connection_parameter_value mm_host_dpi_bfm_pred_avs_b_conv1_inst.m0/pred_inst.avs_b_conv1 baseAddress 0x0000
add_connection mm_host_dpi_bfm_pred_avs_b_conv2_inst.m0 pred_inst.avs_b_conv2 avalon
set_connection_parameter_value mm_host_dpi_bfm_pred_avs_b_conv2_inst.m0/pred_inst.avs_b_conv2 baseAddress 0x0000
add_connection mm_host_dpi_bfm_pred_avs_b_fc1_inst.m0 pred_inst.avs_b_fc1 avalon
set_connection_parameter_value mm_host_dpi_bfm_pred_avs_b_fc1_inst.m0/pred_inst.avs_b_fc1 baseAddress 0x0000
add_connection mm_host_dpi_bfm_pred_avs_b_fc2_inst.m0 pred_inst.avs_b_fc2 avalon
set_connection_parameter_value mm_host_dpi_bfm_pred_avs_b_fc2_inst.m0/pred_inst.avs_b_fc2 baseAddress 0x0000
add_connection mm_host_dpi_bfm_pred_avs_b_fc3_inst.m0 pred_inst.avs_b_fc3 avalon
set_connection_parameter_value mm_host_dpi_bfm_pred_avs_b_fc3_inst.m0/pred_inst.avs_b_fc3 baseAddress 0x0000
add_connection mm_host_dpi_bfm_pred_avs_image_inst.m0 pred_inst.avs_image avalon
set_connection_parameter_value mm_host_dpi_bfm_pred_avs_image_inst.m0/pred_inst.avs_image baseAddress 0x0000
add_connection mm_host_dpi_bfm_pred_avs_probs_inst.m0 pred_inst.avs_probs avalon
set_connection_parameter_value mm_host_dpi_bfm_pred_avs_probs_inst.m0/pred_inst.avs_probs baseAddress 0x0000
add_connection mm_host_dpi_bfm_pred_avs_w_conv1_inst.m0 pred_inst.avs_w_conv1 avalon
set_connection_parameter_value mm_host_dpi_bfm_pred_avs_w_conv1_inst.m0/pred_inst.avs_w_conv1 baseAddress 0x0000
add_connection mm_host_dpi_bfm_pred_avs_w_conv2_inst.m0 pred_inst.avs_w_conv2 avalon
set_connection_parameter_value mm_host_dpi_bfm_pred_avs_w_conv2_inst.m0/pred_inst.avs_w_conv2 baseAddress 0x0000
add_connection mm_host_dpi_bfm_pred_avs_w_fc1_inst.m0 pred_inst.avs_w_fc1 avalon
set_connection_parameter_value mm_host_dpi_bfm_pred_avs_w_fc1_inst.m0/pred_inst.avs_w_fc1 baseAddress 0x0000
add_connection mm_host_dpi_bfm_pred_avs_w_fc2_inst.m0 pred_inst.avs_w_fc2 avalon
set_connection_parameter_value mm_host_dpi_bfm_pred_avs_w_fc2_inst.m0/pred_inst.avs_w_fc2 baseAddress 0x0000
add_connection mm_host_dpi_bfm_pred_avs_w_fc3_inst.m0 pred_inst.avs_w_fc3 avalon
set_connection_parameter_value mm_host_dpi_bfm_pred_avs_w_fc3_inst.m0/pred_inst.avs_w_fc3 baseAddress 0x0000
add_connection component_dpi_controller_pred_inst.component_call pred_inst.call conduit
add_connection component_dpi_controller_pred_inst.component_done concatenate_component_done_inst.in_conduit_0 conduit
add_connection component_dpi_controller_pred_inst.component_wait_for_stream_writes concatenate_component_wait_for_stream_writes_inst.in_conduit_0 conduit
add_connection component_dpi_controller_pred_inst.dpi_control_bind pred_component_dpi_controller_bind_conduit_fanout_inst.in_conduit conduit
add_connection component_dpi_controller_pred_inst.dpi_control_enable pred_component_dpi_controller_enable_conduit_fanout_inst.in_conduit conduit
add_connection component_dpi_controller_pred_inst.read_implicit_streams pred_component_dpi_controller_implicit_ready_conduit_fanout_inst.in_conduit conduit
add_connection component_dpi_controller_pred_inst.readback_from_agents pred_component_dpi_controller_agent_readback_fanout_inst.in_conduit conduit
add_connection concatenate_component_done_inst.out_conduit main_dpi_controller_inst.component_done conduit
add_connection concatenate_component_wait_for_stream_writes_inst.out_conduit main_dpi_controller_inst.component_wait_for_stream_writes conduit
add_connection main_dpi_controller_inst.component_enabled split_component_start_inst.in_conduit conduit
add_connection main_dpi_controller_inst.reset_ctrl clock_reset_inst.reset_ctrl conduit
add_connection mm_host_dpi_bfm_pred_avs_b_conv1_inst.dpi_control_done_reads pred_component_dpi_controller_agent_done_concatenate_inst.in_conduit_0 conduit
add_connection mm_host_dpi_bfm_pred_avs_b_conv1_inst.dpi_control_done_writes pred_component_dpi_controller_agent_ready_concatenate_inst.in_conduit_0 conduit
add_connection mm_host_dpi_bfm_pred_avs_b_conv2_inst.dpi_control_done_reads pred_component_dpi_controller_agent_done_concatenate_inst.in_conduit_1 conduit
add_connection mm_host_dpi_bfm_pred_avs_b_conv2_inst.dpi_control_done_writes pred_component_dpi_controller_agent_ready_concatenate_inst.in_conduit_1 conduit
add_connection mm_host_dpi_bfm_pred_avs_b_fc1_inst.dpi_control_done_reads pred_component_dpi_controller_agent_done_concatenate_inst.in_conduit_2 conduit
add_connection mm_host_dpi_bfm_pred_avs_b_fc1_inst.dpi_control_done_writes pred_component_dpi_controller_agent_ready_concatenate_inst.in_conduit_2 conduit
add_connection mm_host_dpi_bfm_pred_avs_b_fc2_inst.dpi_control_done_reads pred_component_dpi_controller_agent_done_concatenate_inst.in_conduit_3 conduit
add_connection mm_host_dpi_bfm_pred_avs_b_fc2_inst.dpi_control_done_writes pred_component_dpi_controller_agent_ready_concatenate_inst.in_conduit_3 conduit
add_connection mm_host_dpi_bfm_pred_avs_b_fc3_inst.dpi_control_done_reads pred_component_dpi_controller_agent_done_concatenate_inst.in_conduit_4 conduit
add_connection mm_host_dpi_bfm_pred_avs_b_fc3_inst.dpi_control_done_writes pred_component_dpi_controller_agent_ready_concatenate_inst.in_conduit_4 conduit
add_connection mm_host_dpi_bfm_pred_avs_image_inst.dpi_control_done_reads pred_component_dpi_controller_agent_done_concatenate_inst.in_conduit_5 conduit
add_connection mm_host_dpi_bfm_pred_avs_image_inst.dpi_control_done_writes pred_component_dpi_controller_agent_ready_concatenate_inst.in_conduit_5 conduit
add_connection mm_host_dpi_bfm_pred_avs_probs_inst.dpi_control_done_reads pred_component_dpi_controller_agent_done_concatenate_inst.in_conduit_6 conduit
add_connection mm_host_dpi_bfm_pred_avs_probs_inst.dpi_control_done_writes pred_component_dpi_controller_agent_ready_concatenate_inst.in_conduit_6 conduit
add_connection mm_host_dpi_bfm_pred_avs_w_conv1_inst.dpi_control_done_reads pred_component_dpi_controller_agent_done_concatenate_inst.in_conduit_7 conduit
add_connection mm_host_dpi_bfm_pred_avs_w_conv1_inst.dpi_control_done_writes pred_component_dpi_controller_agent_ready_concatenate_inst.in_conduit_7 conduit
add_connection mm_host_dpi_bfm_pred_avs_w_conv2_inst.dpi_control_done_reads pred_component_dpi_controller_agent_done_concatenate_inst.in_conduit_8 conduit
add_connection mm_host_dpi_bfm_pred_avs_w_conv2_inst.dpi_control_done_writes pred_component_dpi_controller_agent_ready_concatenate_inst.in_conduit_8 conduit
add_connection mm_host_dpi_bfm_pred_avs_w_fc1_inst.dpi_control_done_reads pred_component_dpi_controller_agent_done_concatenate_inst.in_conduit_9 conduit
add_connection mm_host_dpi_bfm_pred_avs_w_fc1_inst.dpi_control_done_writes pred_component_dpi_controller_agent_ready_concatenate_inst.in_conduit_9 conduit
add_connection mm_host_dpi_bfm_pred_avs_w_fc2_inst.dpi_control_done_reads pred_component_dpi_controller_agent_done_concatenate_inst.in_conduit_10 conduit
add_connection mm_host_dpi_bfm_pred_avs_w_fc2_inst.dpi_control_done_writes pred_component_dpi_controller_agent_ready_concatenate_inst.in_conduit_10 conduit
add_connection mm_host_dpi_bfm_pred_avs_w_fc3_inst.dpi_control_done_reads pred_component_dpi_controller_agent_done_concatenate_inst.in_conduit_11 conduit
add_connection mm_host_dpi_bfm_pred_avs_w_fc3_inst.dpi_control_done_writes pred_component_dpi_controller_agent_ready_concatenate_inst.in_conduit_11 conduit
add_connection pred_component_dpi_controller_agent_done_concatenate_inst.out_conduit component_dpi_controller_pred_inst.dpi_control_agents_done conduit
add_connection pred_component_dpi_controller_agent_readback_fanout_inst.out_conduit_0 mm_host_dpi_bfm_pred_avs_b_conv1_inst.dpi_control_component_done conduit
add_connection pred_component_dpi_controller_agent_readback_fanout_inst.out_conduit_1 mm_host_dpi_bfm_pred_avs_b_conv2_inst.dpi_control_component_done conduit
add_connection pred_component_dpi_controller_agent_readback_fanout_inst.out_conduit_2 mm_host_dpi_bfm_pred_avs_b_fc1_inst.dpi_control_component_done conduit
add_connection pred_component_dpi_controller_agent_readback_fanout_inst.out_conduit_3 mm_host_dpi_bfm_pred_avs_b_fc2_inst.dpi_control_component_done conduit
add_connection pred_component_dpi_controller_agent_readback_fanout_inst.out_conduit_4 mm_host_dpi_bfm_pred_avs_b_fc3_inst.dpi_control_component_done conduit
add_connection pred_component_dpi_controller_agent_readback_fanout_inst.out_conduit_5 mm_host_dpi_bfm_pred_avs_image_inst.dpi_control_component_done conduit
add_connection pred_component_dpi_controller_agent_readback_fanout_inst.out_conduit_6 mm_host_dpi_bfm_pred_avs_probs_inst.dpi_control_component_done conduit
add_connection pred_component_dpi_controller_agent_readback_fanout_inst.out_conduit_7 mm_host_dpi_bfm_pred_avs_w_conv1_inst.dpi_control_component_done conduit
add_connection pred_component_dpi_controller_agent_readback_fanout_inst.out_conduit_8 mm_host_dpi_bfm_pred_avs_w_conv2_inst.dpi_control_component_done conduit
add_connection pred_component_dpi_controller_agent_readback_fanout_inst.out_conduit_9 mm_host_dpi_bfm_pred_avs_w_fc1_inst.dpi_control_component_done conduit
add_connection pred_component_dpi_controller_agent_readback_fanout_inst.out_conduit_10 mm_host_dpi_bfm_pred_avs_w_fc2_inst.dpi_control_component_done conduit
add_connection pred_component_dpi_controller_agent_readback_fanout_inst.out_conduit_11 mm_host_dpi_bfm_pred_avs_w_fc3_inst.dpi_control_component_done conduit
add_connection pred_component_dpi_controller_agent_ready_concatenate_inst.out_conduit component_dpi_controller_pred_inst.dpi_control_agents_ready conduit
add_connection pred_component_dpi_controller_bind_conduit_fanout_inst.out_conduit_0 mm_host_dpi_bfm_pred_avs_b_conv1_inst.dpi_control_bind conduit
add_connection pred_component_dpi_controller_bind_conduit_fanout_inst.out_conduit_1 mm_host_dpi_bfm_pred_avs_b_conv2_inst.dpi_control_bind conduit
add_connection pred_component_dpi_controller_bind_conduit_fanout_inst.out_conduit_2 mm_host_dpi_bfm_pred_avs_b_fc1_inst.dpi_control_bind conduit
add_connection pred_component_dpi_controller_bind_conduit_fanout_inst.out_conduit_3 mm_host_dpi_bfm_pred_avs_b_fc2_inst.dpi_control_bind conduit
add_connection pred_component_dpi_controller_bind_conduit_fanout_inst.out_conduit_4 mm_host_dpi_bfm_pred_avs_b_fc3_inst.dpi_control_bind conduit
add_connection pred_component_dpi_controller_bind_conduit_fanout_inst.out_conduit_5 mm_host_dpi_bfm_pred_avs_image_inst.dpi_control_bind conduit
add_connection pred_component_dpi_controller_bind_conduit_fanout_inst.out_conduit_6 mm_host_dpi_bfm_pred_avs_probs_inst.dpi_control_bind conduit
add_connection pred_component_dpi_controller_bind_conduit_fanout_inst.out_conduit_7 mm_host_dpi_bfm_pred_avs_w_conv1_inst.dpi_control_bind conduit
add_connection pred_component_dpi_controller_bind_conduit_fanout_inst.out_conduit_8 mm_host_dpi_bfm_pred_avs_w_conv2_inst.dpi_control_bind conduit
add_connection pred_component_dpi_controller_bind_conduit_fanout_inst.out_conduit_9 mm_host_dpi_bfm_pred_avs_w_fc1_inst.dpi_control_bind conduit
add_connection pred_component_dpi_controller_bind_conduit_fanout_inst.out_conduit_10 mm_host_dpi_bfm_pred_avs_w_fc2_inst.dpi_control_bind conduit
add_connection pred_component_dpi_controller_bind_conduit_fanout_inst.out_conduit_11 mm_host_dpi_bfm_pred_avs_w_fc3_inst.dpi_control_bind conduit
add_connection pred_component_dpi_controller_enable_conduit_fanout_inst.out_conduit_0 mm_host_dpi_bfm_pred_avs_b_conv1_inst.dpi_control_enable conduit
add_connection pred_component_dpi_controller_enable_conduit_fanout_inst.out_conduit_1 mm_host_dpi_bfm_pred_avs_b_conv2_inst.dpi_control_enable conduit
add_connection pred_component_dpi_controller_enable_conduit_fanout_inst.out_conduit_2 mm_host_dpi_bfm_pred_avs_b_fc1_inst.dpi_control_enable conduit
add_connection pred_component_dpi_controller_enable_conduit_fanout_inst.out_conduit_3 mm_host_dpi_bfm_pred_avs_b_fc2_inst.dpi_control_enable conduit
add_connection pred_component_dpi_controller_enable_conduit_fanout_inst.out_conduit_4 mm_host_dpi_bfm_pred_avs_b_fc3_inst.dpi_control_enable conduit
add_connection pred_component_dpi_controller_enable_conduit_fanout_inst.out_conduit_5 mm_host_dpi_bfm_pred_avs_image_inst.dpi_control_enable conduit
